# EAGLE design 30w developer board v3 (EAGLE 5.07)
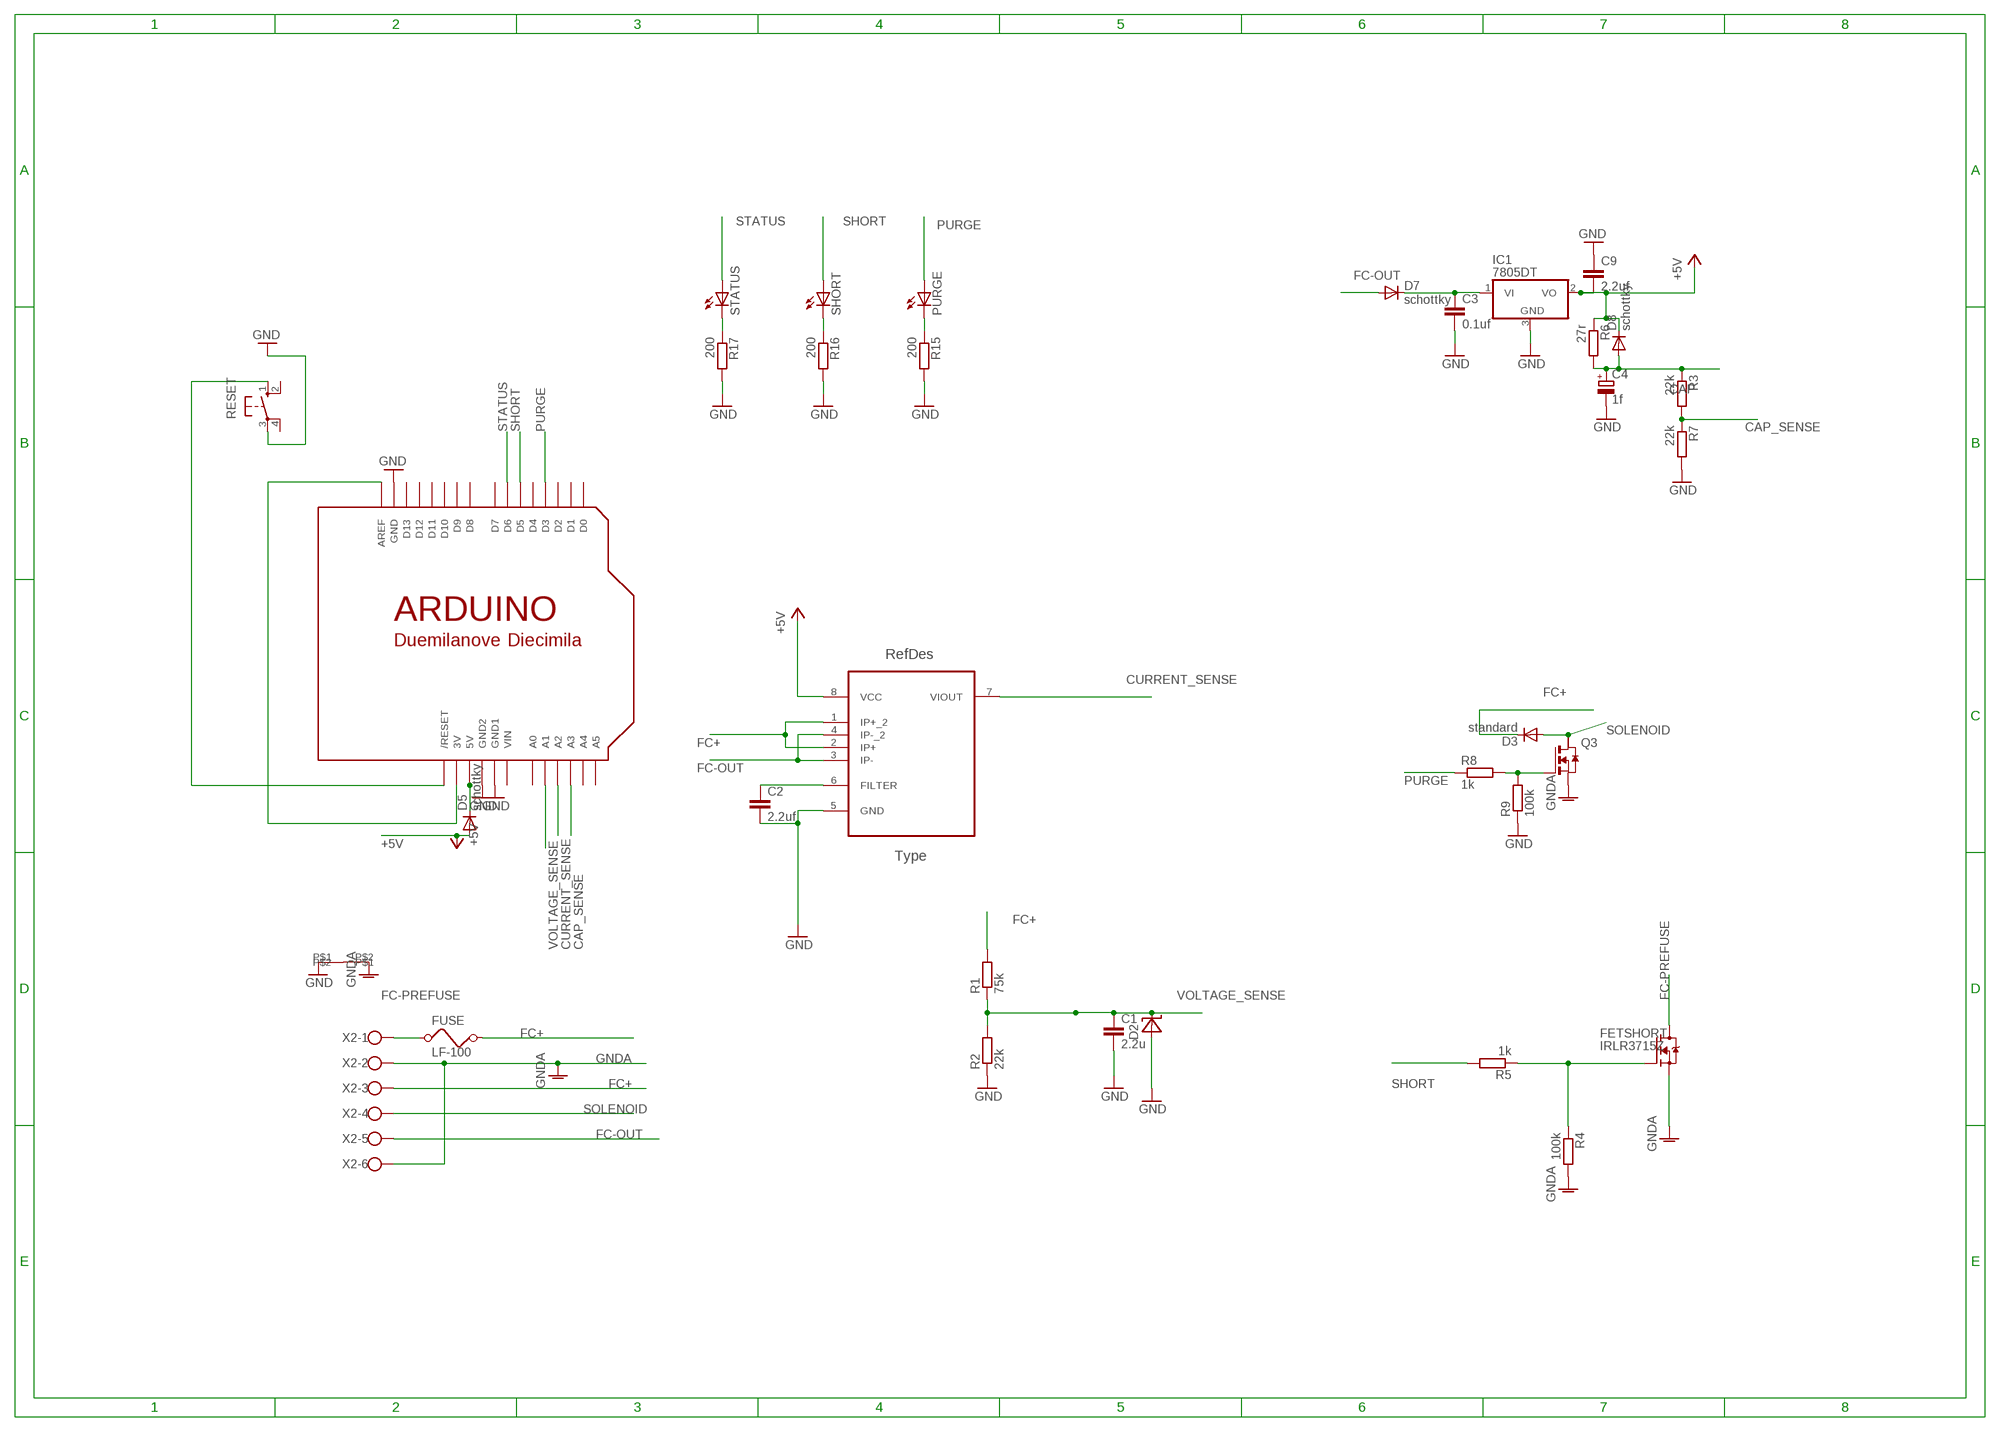
[diagram p0: schematic, sheet 1]

## Parts
C1  2.2u  C-EUC1206  [C1206]
C2  2.2uf  C-EUC1206  [C1206]
C3  0.1uf  C-EUC1206  [C1206]
C4  1f  CPOL-EUE10-20  [EB20D]
C9  2.2uf  C-EUC1206  [C1206]
D2  1206ZENER  [C1206]
D3  standard  DIODE-DO214AA  [DO214AA]
D5  schottky  DIODE-SMB  [SMB]
D7  schottky  DIODE-SMB  [SMB]
D8  schottky  DIODE-SMB  [SMB]
FETSHORT  IRLR3715Z  [TO252]
FUSE  LF-100  FUSE  [SMTREPLACEFUSE]
IC1  7805DT  [TO252]
PURGE  LEDSMT1206  [1206]
Q3  NMOSSOT223  [SOT223]
R1  75k  R-EU_R1206  [R1206]
R2  22k  R-EU_R1206  [R1206]
R3  22k  R-EU_M1206  [M1206]
R4  100k  R-EU_M1206  [M1206]
R5  1k  R-EU_M1206  [M1206]
R6  27r  R-EU_R2512  [R2512]
R7  22k  R-EU_M1206  [M1206]
R8  1k  R-EU_M1206  [M1206]
R9  100k  R-EU_M1206  [M1206]
R15  200  R-EU_M1206  [M1206]
R16  200  R-EU_M1206  [M1206]
R17  200  R-EU_M1206  [M1206]
RESET  10-XX  [B3F-10XX]
SHORT  LEDSMT1206  [1206]
STATUS  LEDSMT1206  [1206]
U1  ACS712ELCTR-05B-T  [SOIC127P600X175-8N]
U$1  ARDUINO-NOHOLE  [ARDUINO-NOHOLE]
U$2  SHORT  [SHORT]
X2  W237-6  [W237-6]

## Nets
+5V [medpower]: C9.2 D5.A D8.C IC1.2(VO) R6.1 U1.8(VCC)
CAP: C4.+ D8.A R3.1 R6.2
CAP_SENSE: R3.2 R7.1 U$1.A3
CURRENT_SENSE: U1.7(VIOUT) U$1.A2
FC+ [power]: D3.C FUSE.P$3 R1.2 U1.1(IP+_2) U1.2(IP+) X2.3
FC-OUT: D7.A U1.3(IP-) U1.4(IP-_2) X2.5
FC-PREFUSE: FETSHORT.3(D) FUSE.P$2 X2.1
GND [medpower]: C1.2 C2.2 C3.2 C4.- C9.1 D2.ANODE(A) IC1.3(GND) R2.1 R7.2 R9.1 R15.2 R16.2 R17.2 RESET.3(P) U1.5(GND) U$1.GND U$1.GND1 U$1.GND2 U$2.P$1
GNDA [power]: FETSHORT.2(S) Q3.3(S) R4.2 U$2.P$2 X2.2 X2.6
N$1: D5.C U$1.5V
N$2: Q3.1(G) R8.2 R9.2
N$3: C3.1 D7.C IC1.1(VI)
N$5: C2.1 U1.6(FILTER)
N$6: U$1.3V U$1.AREF
N$7: PURGE.C R15.1
N$11: R16.1 SHORT.C
N$12: R17.1 STATUS.C
N$14: FETSHORT.1(G) R4.1 R5.1
PURGE: PURGE.A R8.1 U$1.D3
RESET: RESET.1(S) U$1.RESET(/RESET)
SHORT: R5.2 SHORT.A U$1.D5
SOLENOID [medpower]: D3.A Q3.2(D) X2.4
STATUS: STATUS.A U$1.D6
VOLTAGE_SENSE: C1.1 D2.CATHODE(C) R1.1 R2.2 U$1.A1
Unconnected: Q3.4(D2) RESET.2(S1) RESET.4(P1) U$1.A0 U$1.A4 U$1.A5 U$1.D0 U$1.D1 U$1.D2 U$1.D4 U$1.D7 U$1.D8 U$1.D9 U$1.D10 U$1.D11 U$1.D12 U$1.D13

## Power pins joined to a net without a drawn wire
VIN: U$1.VIN

## Library data of the parts
C1 C2 = matt rcl:C-EU: CAPACITOR, European symbol
C3 C9 = resistor:C-EU: CAPACITOR, European symbol
C4 = matt rcl:CPOL-EU: POLARIZED CAPACITOR, European symbol
D2 = matt diode:1206ZENER
D3 = matt diode:DIODE-: DIODE
D5 D7 D8 = diode:DIODE-: DIODE
FETSHORT = matt transistor-fet:IRLR3715Z
FUSE = matt special:FUSE: FUSE 5 x 20 mm
IC1 = linear:78*: Positive VOLTAGE REGULATOR Source: http://cache.national.com/ds/LM/LM78L05.pdf http://www.fairchildsemi.com/ds/LM/LM7805.pdf
PURGE SHORT STATUS = matt led:LED: LED OSRAM: - CHIPLED LG R971, LG N971, LY N971, LG Q971, LY Q971, LO R971, LY R971 LH N974, LH R974 LS Q976, LO Q976, LY Q976 LO Q996 - Hyper CHIPLED LW Q18S LB Q993, LB Q99A, LB R99A - SideLED LS A670, LO A670, LY A670, LG A670, LP A670 LB A673, LV A673, LT A673, LW A673 LH A674 LY A675 LS A676, LA A676, LO A676, LY A676, LW A676 LS A679, LY A679, LG A679 - Hyper Micro SIDELED® LS Y876, LA Y876, LO Y876, LY Y876 LT Y87S - SmartLED LW L88C, LW L88S LB L89C, LB L89S, LG L890 LS L89K, LO L89K, LY L89K LS L896, LA L896, LO L896, LY L896 - TOPLED LS T670, LO T670, LY T670, LG T670, LP T670 LSG T670, LSP T670, LSY T670, LOP T670, LYG T670 LG T671, LOG T671, LSG T671 LB T673, LV T673, LT T673, LW T673 LH T674 LS T676, LA T676, LO T676, LY T676, LB T676, LH T676, LSB T676, LW T676 LB T67C, LV T67C, LT T67C, LS T67K, LO T67K, LY T67K, LW E67C LS E67B, LA E67B, LO E67B, LY E67B, LB E67C, LV E67C, LT E67C LW T67C LS T679, LY T679, LG T679 LS T770, LO T770, LY T770, LG T770, LP T770 LB T773, LV T773, LT T773, LW T773 LH T774 LS E675, LA E675, LY E675, LS T675 LS T776, LA T776, LO T776, LY T776, LB T776 LHGB T686 LT T68C, LB T68C - Hyper Mini TOPLED® LB M676 - Mini TOPLED Santana® LG M470 LS M47K, LO M47K, LY M47K Source: http://www.osram.convergy.de LUXEON: - LUMILED® LXK2-PW12-R00, LXK2-PW12-S00, LXK2-PW14-U00, LXK2-PW14-V00 LXK2-PM12-R00, LXK2-PM12-S00, LXK2-PM14-U00 LXK2-PE12-Q00, LXK2-PE12-R00, LXK2-PE12-S00, LXK2-PE14-T00, LXK2-PE14-U00 LXK2-PB12-K00, LXK2-PB12-L00, LXK2-PB12-M00, LXK2-PB14-N00, LXK2-PB14-P00, LXK2-PB14-Q00 LXK2-PR12-L00, LXK2-PR12-M00, LXK2-PR14-Q00, LXK2-PR14-R00 LXK2-PD12-Q00, LXK2-PD12-R00, LXK2-PD12-S00 LXK2-PH12-R00, LXK2-PH12-S00 LXK2-PL12-P00, LXK2-PL12-Q00, LXK2-PL12-R00 Source: www.luxeon.com KINGBRIGHT: KA-3528ASYC Source: www.kingbright.com
Q3 = zetex:NMOSSOT223: MOS FET
R1 R2 R6 = matt rcl:R-EU_: RESISTOR, European symbol
R3-R5 R7-R9 R15-R17 = resistor:R-EU_: RESISTOR, European symbol
RESET = switch-omron:10-XX: OMRON SWITCH
U1 = matt-allegro:ACS712ELCTR-05B-T: Linear Current Sensor; DESCRIPTION: Linear Current Sensor; MPN: ACS712ELCTR-05B-T; OC_FARNELL: 27M3644; OC_NEWARK: 1329623; PACKAGE: SOIC-8; SUPPLIER: Allegro
U$1 = adafruit:ARDUINO: Arduino Diecimila/Duemilanove Make a shield with ease, this package has all the named pins as well as the two mounting drill holes and an outline of the USB and DC power connector. The outline is on the DIMENSION layer, so if your board house uses it they will cut the outline to match. http://www.ladyada.net/library/pcb/eaglelibrary.html
U$2 = matt:SHORT
X2 = con-wago-500:W237-6: WAGO SCREW CLAMP

## Net classes
1 power: width 3 mm
2 medpower: width 1 mm

## Board
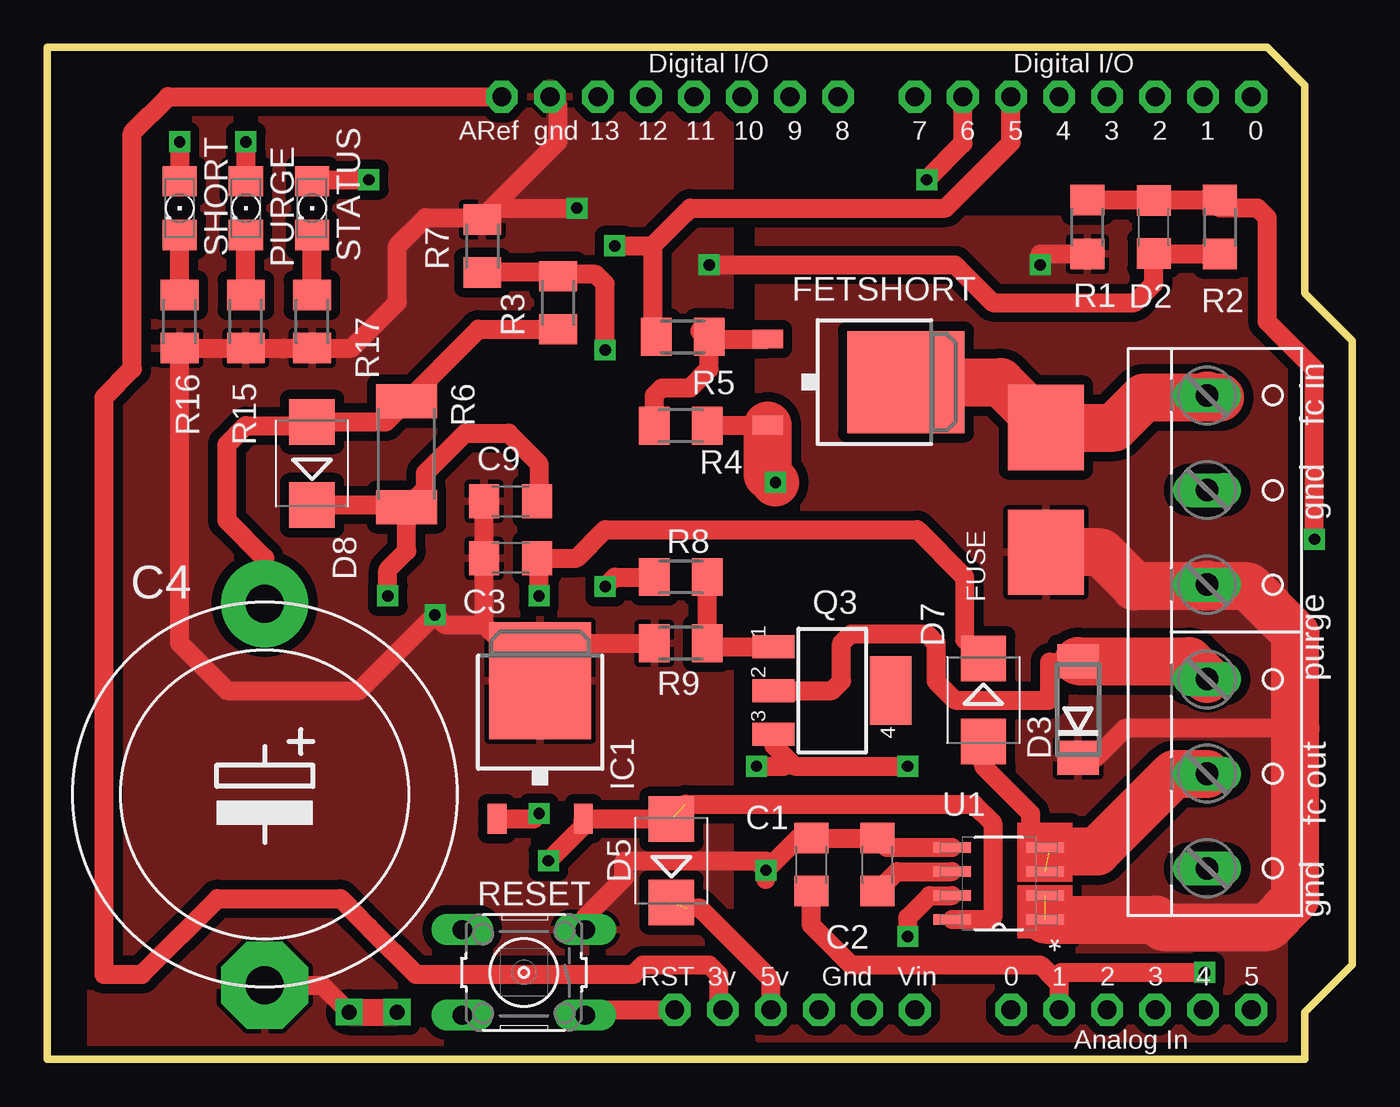
[diagram p1: board, top side]
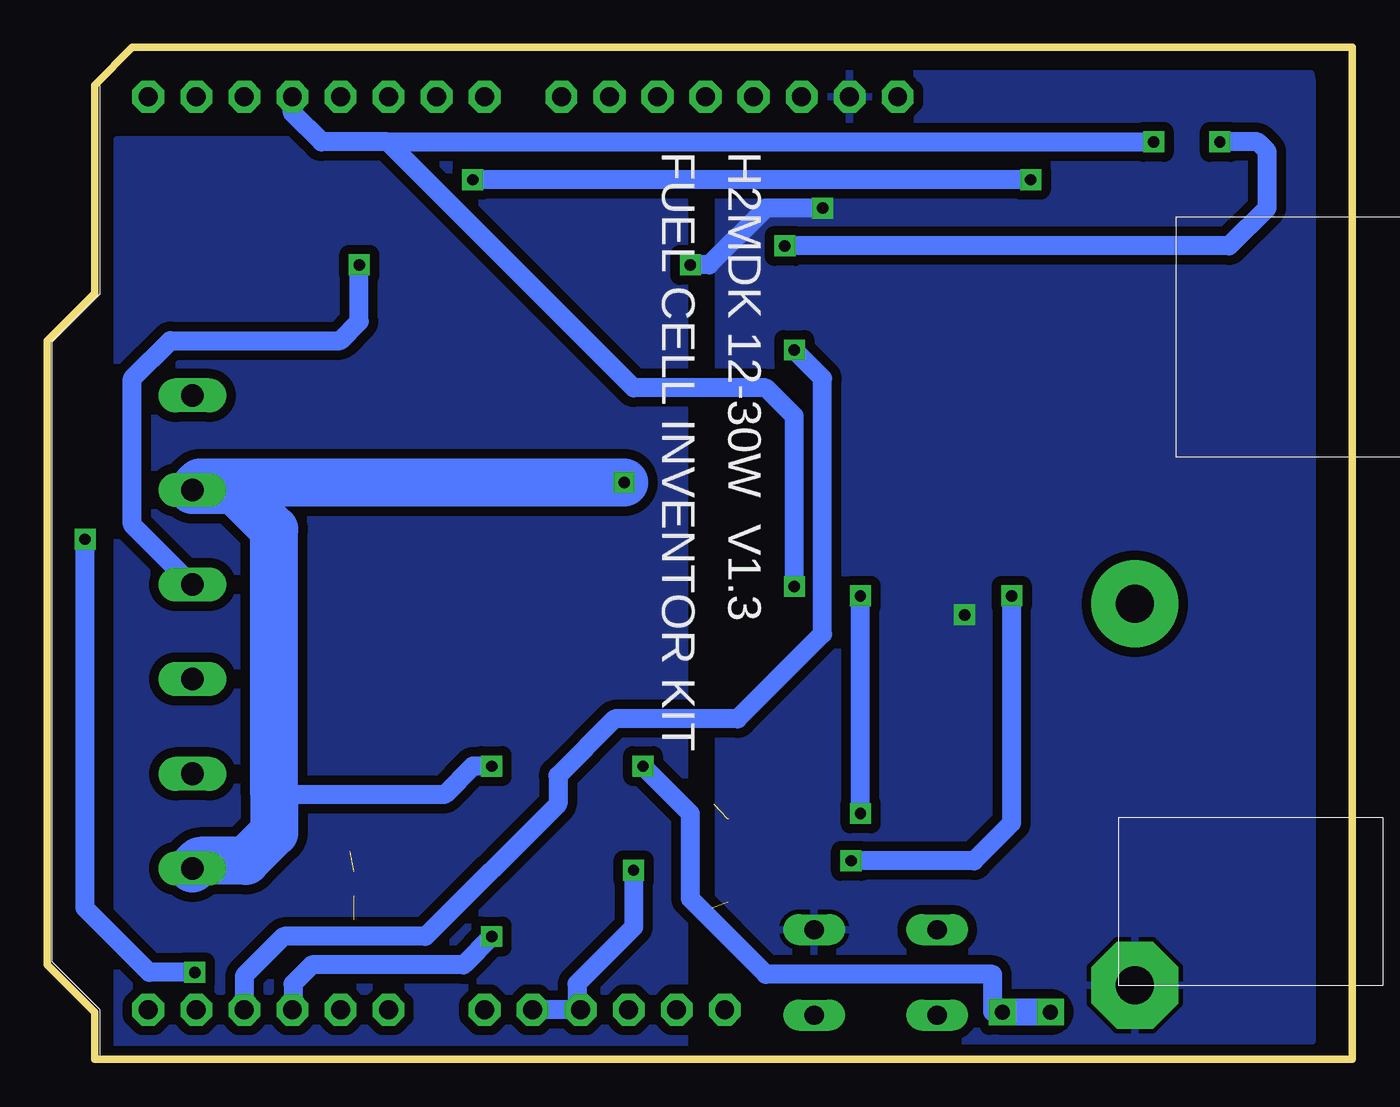
[diagram p2: board, bottom side, seen from below]

Size 69 x 53.5 mm. Coordinates in mm from the lower left corner, seen from the top.
Outline: 0,53.5 64.5,53.5 66.5,51.5 66.5,40.5 69,38 69,5 66.5,2.5 66.5,0 0,0 0,53.5
Copper layers (1*16): Top 0.035mm / dielectric 1.5mm / Bottom 0.035mm
Design rules "SparkFun *": minimum track width 10mil, minimum drill 20mil, track to track 10mil, track to pad 10mil, pad to pad 10mil, via to via 10mil, smd to smd 10mil, copper to edge 10mil, drill to drill 10mil, minimum pad ring 12mil, minimum via ring 10mil, stop-mask expansion 4mil, vias tented up to drill 25mil, thermal gap 10mil

### Footprints (pad centres in the part's own frame; a part is rotated, then mirrored left to right if it is on the bottom)
C1206 = smd 1.6 x 1.8: 1 -1.4,0; 2 1.4,0
EB20D = drill 2.007 pad 4.597 round: + -10.08,0 | drill 2.007 pad 4.597 octagon: - 10.08,0
C1206' = smd 1.6 x 1.8: ANODE -1.4,0; CATHODE 1.4,0
DO214AA = smd 1.8 x 2.2: A 2.55,0; C -2.55,0
SMB = smd 2.4 x 2.4: A 2.2,0; C -2.2,0
TO252 = smd 1 x 1.6: 1 -2.28,-4.8; 2 2.28,-4.8 | smd 5.4 x 6.2: 3 0,2.5
SMTREPLACEFUSE = smd 4.5 x 4: P$2 3.2,-0.1; P$3 -3.4,-0.1
1206 = smd 1.6 x 1.803: A -1.422,0; C 1.422,0
SOT223 = smd 1.219 x 2.235: 1 -2.311,-3.099; 2 0,-3.099; 3 2.311,-3.099 | smd 3.6 x 2.2: 4 0,3.099
R1206 = smd 1.6 x 1.803: 1 -1.422,0; 2 1.422,0
M1206 = smd 1.6 x 2: 1 -1.4,0; 2 1.4,0
R2512 = smd 1.8 x 3.2: 1 -2.8,0; 2 2.8,0
B3F-10XX = drill 1.016 long: 1 -3.251,2.261; 2 3.251,2.261; 3 -3.251,-2.261; 4 3.251,-2.261
SOIC127P600X175-8N = smd 1.981 x 0.559: 1 -2.464,1.905; 2 -2.464,0.635; 3 -2.464,-0.635; 4 -2.464,-1.905; 5 2.464,-1.905; 6 2.464,-0.635; 7 2.464,0.635; 8 2.464,1.905
ARDUINO-NOHOLE@1 = drill 1 pad 1.676 octagon: 3V 35.56,2.54; 5V 38.1,2.54; A0 50.8,2.54; A1 53.34,2.54; A2 55.88,2.54; A3 58.42,2.54; A4 60.96,2.54; A5 63.5,2.54; AREF 23.876,50.8; D0 63.5,50.8; D1 60.96,50.8; D2 58.42,50.8; D3 55.88,50.8; D4 53.34,50.8; D5 50.8,50.8; D6 48.26,50.8; D7 45.72,50.8; D8 41.656,50.8; D9 39.116,50.8; D10 36.576,50.8; D11 34.036,50.8; D12 31.496,50.8; D13 28.956,50.8; GND 26.416,50.8; GND1 43.18,2.54; GND2 40.64,2.54; RESET 33.02,2.54; VIN 45.72,2.54
SHORT = drill 0.8 square: P$1 -2.54,0; P$2 0,0
W237-6 = drill 1.194 long: 1 -12.5,-1.27; 2 -7.5,-1.27; 3 -2.5,-1.27; 4 2.5,-1.27; 5 7.5,-1.27; 6 12.5,-1.27

### Placement (x,y rotation side)
C1  40.4,10.3 90 top
C2  43.9,10.3 90 top
C3  24.5,26.5 180 top
C4  11.5,14 270 top
C9  24.5,29.5 0 top
D2  [C1206']  58.5,44 90 top
D3  54.5,18.5 90 top
D5  33,10.5 90 top
D7  49.5,19 270 top
D8  14,31.5 90 top
FETSHORT  42.9,35.8 270 top
FUSE  52.7,30.2 90 top
IC1  26.06,17.52 0 top
PURGE  10.5,45 270 top
Q3  41.5,19.5 270 top
R1  55,44 270 top
R2  62,44 90 top
R3  27,40 90 top
R4  33.5,33.5 0 top
R5  33.6,38.2 180 top
R6  19,32 90 top
R7  23,43 90 top
R8  33.5,25.5 0 top
R9  33.5,22 0 top
R15  10.5,39 270 top
R16  7,39 270 top
R17  14,39 270 top
RESET  25.2,4.6 180 top
SHORT  7,45 270 top
STATUS  14,45 270 top
U1  50.31,9.3 180 top
U$1  ARDUINO-NOHOLE  [ARDUINO-NOHOLE@1]  0.16,0.09 0 top
U$2  18.5,2.5 0 top
U$3  [FABLABLOGO]  58.5,5.5 90 top
X2  62.6,22.6 270 top

### Tracks (layer width: path | path; a pad name or v marks a point on that pad's centre or on a via)
+5V  (via drill 0.6)  (2 unrouted)
  Top 1.016: 32.97,12.72 IC1.2 28.34,12.34 v26.5,10.5 | 33.75,13.5 49,13.5 50,12.5 50,7.5 49.9,7.39 U1.8 | v18,24.5 18,25.88 19,26.88 R6.1 | C9.2 26,29.6 26,31.5 24.4,33.1 22.1,33.1 20,31 20,30.2 R6.1 | D8.C 18.9,29.3 R6.1
  Bottom 1.016: v26.5,10.5 20,10.5 18,12.5 v18,24.5
CAP
  Top 1.016: 12.08,24.08 C4.+ 11.5,26.5 9.5,28.5 9.5,32.5 10.5,33.5 13.8,33.5 D8.A 17.9,33.7 R6.2 22.8,38.6 R3.1
CAP_SENSE  (via drill 0.6)
  Top 1.016: R7.1 26.8,41.6 R3.2 27.1,41.5 29,41.5 29.5,41 v29.5,37.5
  Bottom 1.016: U$1.A3 58.58,4.42 56.5,6.5 49,6.5 42,13.5 42,15 39,18 32.5,18 28,22.5 28,36 v29.5,37.5
CURRENT_SENSE  (via drill 0.6)
  Top 1.016: U1.7 46.66,8.66 45.5,7.5 v45.5,6.5
  Bottom 1.016: v45.5,6.5 47,5 55,5 56,4 56,2.67 U$1.A2
FC+  (via drill 0.6)  (1 unrouted)
  Top 1.016: D3.C 55.45,15.95 57,17.5 66,17.5 | R1.2 52.5,42.58 v52.5,42
  Top 2.54: FUSE.P$3 55.7,26.8 57.5,25 61.23,25 | 61.23,25 X2.3 | U1.1 58.6,7.39 59,7 64.5,7 66,8.5 66,17.5 66,22.5 63.5,25 61.23,25
  Bottom 1.016: v52.5,42 52.5,39 53.5,38 62.5,38 64.5,36 64.5,28.27 X2.3
  pour Top (isolate 0.5): 37.8,44.4 65.4,44.4 65.4,1.1 37.6,1.1 37.6,44.2
FC-OUT  (1 unrouted)
  Top 1.016: D7.A 49.5,15.5 52,13 52,11.98 U1.4 52.5,11.48
  Top 2.54: X2.5 59.6,15.1 55.5,11 52.98,11 U1.4
FC-PREFUSE
  Top 2.54: 61.43,35 58,35 56.4,33.4 FUSE.P$2 50.4,35.8 FETSHORT.3 | 61.43,35 62,35 | 61.43,35 X2.1
GND  (via drill 0.6)
  Top 1.016: 12.5,37.6 R15.2 R16.2 7,22 9.5,19.5 16.5,19.5 v20.5,23.5 21.02,22.98 23.1,22.98 | 12.5,37.6 R17.2 16.1,37.6 18.5,40 18.5,43 20,44.5 22.9,44.5 R7.2 23,44.5 23.5,45 | R9.1 28.04,22 IC1.3 23.1,22.98 | 23.1,22.98 C3.2 C9.1 | U1.5 44.4,11.21 C2.2 C1.2 39.7,11.7 v38,10 | 23.5,45 27,48.5 27,50.47 U$1.GND | v38,10 38,9.5 | v38,10 37.5,10.5 | R2.1 58.5,42.58 D2.ANODE 58.5,41 57.5,40 50,40 48,42 v35,42 | 23.5,45 v28,45 | 12.5,37.6 12.45,37.55 | C4.- 14.54,3.92 U$2.P$1 | RESET.3 28.45,7.53 30.5,9.58 30.5,10.5 38,10.5 v38,10
  Bottom 1.016: U$1.GND1 U$1.GND2 41,2.83 41,4 38,7 v38,10 | v35,42 34,42 31,45 v28,45
  pour Bottom (isolate 0.5): 2.2,52.1 33.5,52.1 33.5,1 2.1,1 2.1,51.7
  pour Top (isolate 0.5): 2.4,51.6 36.1,51.6 36.1,0.8 2.3,0.8 2.3,51.3
GND_A
  pour Bottom (isolate 0.5): 35.4,48.6 65.3,48.6 65.3,0.1 35.3,0.1 35.3,48.3
GNDA  (via drill 0.6)
  Top 1.016: v45.5,15.5 39.5,15.5 39.25,15.75 | R4.2 38.08,33.5 FETSHORT.2 | Q3.3 38.4,16.6 39.25,15.75 | v37.5,15.5 39,15.5 39.25,15.75
  Top 2.54: FETSHORT.2 38.1,30.9 v38.5,30.5
  Bottom 1.016: U$2.P$2 19,2.5 19,4.5 31,4.5 35,8.5 35,13 v37.5,15.5 | v45.5,15.5 46.5,15.5 48,14 57,14
  Bottom 2.54: X2.6 60.93,10.5 58.5,10.5 57,12 57,14 57,28 59.1,30.1 X2.2 60.93,30.5 v38.5,30.5
N$1  (1 unrouted)
  Top 1.016: U$1.5V 38.26,4.24 34.5,8 33.85,8
N$2
  Top 1.016: Q3.1 35.09,21.81 R9.2 R8.2
N$3  (via drill 0.6)
  Top 1.016: IC1.1 25.72,12.72 v26,13 | v26,24.5 26,26.4 C3.1 28,26.5 29.5,28 46,28 48.5,25.5 48.5,22.2 D7.C
  Bottom 1.016: v26,13 v26,24.5
N$5
  Top 1.016: U1.6 44.94,9.94 C2.1
N$6
  Top 1.016: U$1.AREF 6.39,50.89 4.5,49 4.5,36.5 3,35 3,4.5 5,4.5 9,8.5 15.5,8.5 16.5,7.5 17,7 19.5,4.5 31,4.5 31.5,5 35,5 35.5,4.5 35.5,2.85 U$1.3V
N$7
  Top 1.016: R15.1 PURGE.C
N$11
  Top 1.016: R16.1 SHORT.C
N$12
  Top 1.016: R17.1 STATUS.C
N$14
  Top 1.016: FETSHORT.1 34.92,38.08 34.5,38.5 34.7,38.5 R5.1 35,36.5 34,35.5 32.5,35.5 32.1,35.1 R4.1
PURGE  (via drill 0.6)
  Top 1.016: v10.5,48.5 PURGE.A | R8.1 30,25.5 v29.5,25
  Bottom 1.016: U$1.D3 56.04,50.04 54.5,48.5 51,48.5 | 51,48.5 v10.5,48.5 | v29.5,25 29.5,34 31,35.5 38,35.5 51,48.5
RESET
  Top 1.016: U$1.RESET 28.74,2.63 RESET.1
SHORT  (via drill 0.6)
  Top 1.016: U$1.D5 50.96,48.46 47.5,45 34,45 33.75,44.75 32,43 | 32,43 32,38.4 R5.2 | v7,48.5 SHORT.A | v30,43 32,43
  Bottom 1.016: v30,43 6.5,43 4.5,45 4.5,48 5,48.5 v7,48.5
SOLENOID
  Top 1.016: Q3.2 41.5,19.5 42,20 42,22 42.5,22.5 46.5,22.5 47,22 47,20 48,19 53,19 53,21 54.45,21 D3.A
  Top 2.54: D3.A 60.38,21.05 X2.4
STATUS  (via drill 0.6)
  Top 1.016: U$1.D6 48.42,48.42 v46.5,46.5 | v17,46.5 14.08,46.5 STATUS.A
  Bottom 1.016: v17,46.5 v46.5,46.5
VOLTAGE_SENSE  (via drill 0.6)
  Top 1.016: R1.1 58.48,45.42 D2.CATHODE 58.52,45.42 R2.2 62,45 64,45 64.5,44.5 64.5,39 67,36.5 v67,27.5 | C1.1 40.4,7.1 42.5,5 52.5,5 53.25,4.25 | 53.25,4.25 53.5,4 U$1.A1 | v61.2,4.6 53.6,4.6 53.25,4.25
  Bottom 1.016: v67,27.5 67,8 63.6,4.6 v61.2,4.6
(copper drawn outside any net)
  shapes: Top area x2

### Text on the board
tPlace: purge
tNames: fc in | gnd | fc out | gnd
bNames: H2MDK 12-30W V1.3 | FUEL CELL INVENTOR KIT